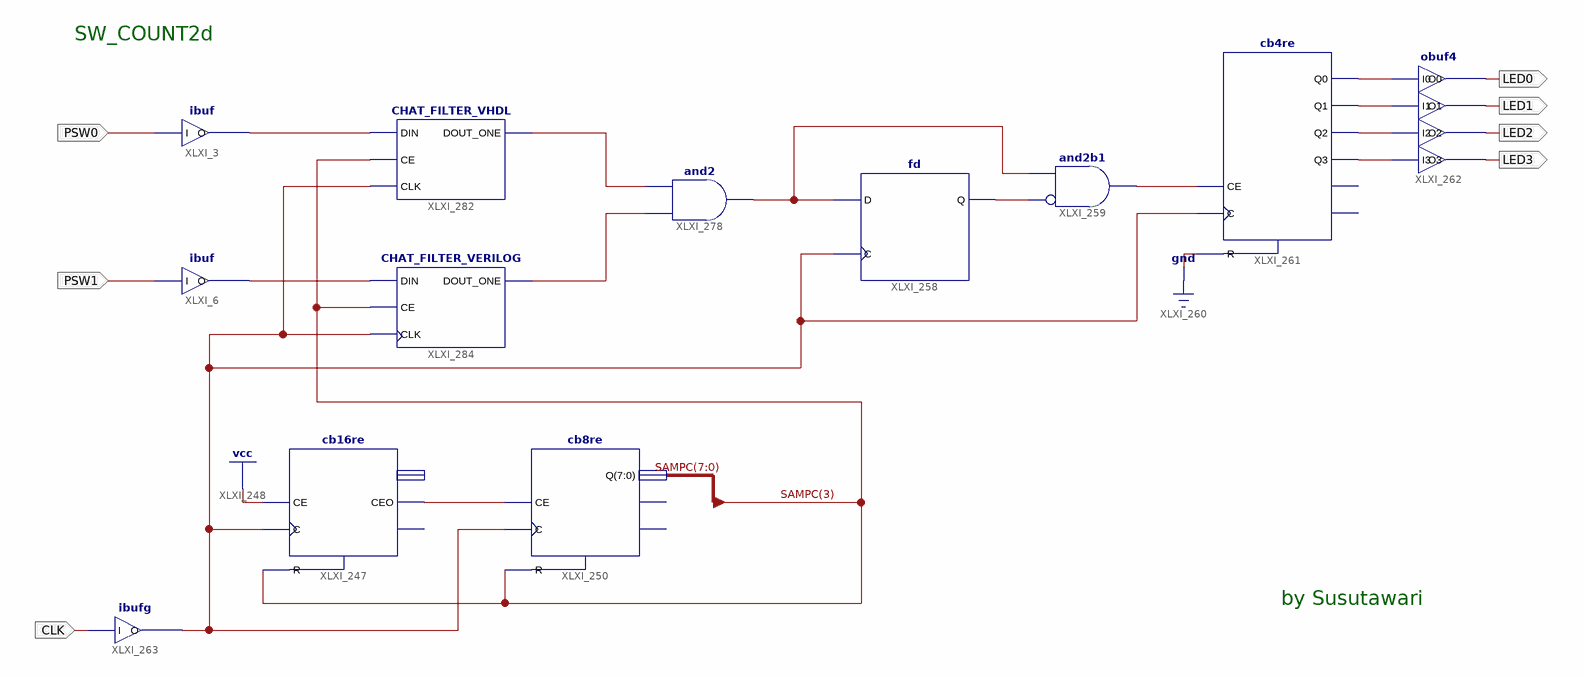
[diagram p0: schematic sheet 1]
// Xilinx ISE schematic SW_COUNT2d.sch (spartan3a) as structural Verilog: 12 symbols, 7 ports
module SW_COUNT2d (
  input  CLK,
  input  PSW0,
  input  PSW1,
  output LED0,
  output LED1,
  output LED2,
  output LED3
);

  wire LA_CLK, LAA0, XLXN_1216, XLXN_1219, XLXN_1235, XLXN_1236, XLXN_1245, XLXN_1246, XLXN_1247, XLXN_1248,
       XLXN_1369, XLXN_1370, XLXN_1374;
  wire [7:0] SAMPC;

  cb16re XLXI_247 (.C(LA_CLK), .CE(1'b1), .R(SAMPC[3]), .CEO(XLXN_1216));  // open: Q, TC
  cb8re XLXI_250 (.C(LA_CLK), .CE(XLXN_1216), .R(SAMPC[3]), .Q(SAMPC));  // open: CEO, TC
  ibufg XLXI_263 (.I(CLK), .O(LA_CLK));
  ibuf XLXI_3 (.I(PSW0), .O(LAA0));
  ibuf XLXI_6 (.I(PSW1), .O(XLXN_1219));
  and XLXI_278 (XLXN_1374, XLXN_1370, XLXN_1369);
  fd XLXI_258 (.C(LA_CLK), .D(XLXN_1374), .Q(XLXN_1235));
  and XLXI_259 (XLXN_1236, ~XLXN_1235, XLXN_1374);  // and2b1
  cb4re XLXI_261 (
    .C(LA_CLK), .CE(XLXN_1236), .R(1'b0), .Q0(XLXN_1245), .Q1(XLXN_1246), .Q2(XLXN_1247), .Q3(XLXN_1248));  // open: CEO, TC
  obuf4 XLXI_262 (
    .I0(XLXN_1245), .I1(XLXN_1246), .I2(XLXN_1247), .I3(XLXN_1248), .O0(LED0), .O1(LED1), .O2(LED2), .O3(LED3));
  CHAT_FILTER_VHDL XLXI_282 (.DIN(LAA0), .CE(SAMPC[3]), .CLK(LA_CLK), .DOUT_ONE(XLXN_1369));
  CHAT_FILTER_VERILOG XLXI_284 (.DIN(XLXN_1219), .CE(SAMPC[3]), .CLK(LA_CLK), .DOUT_ONE(XLXN_1370));

  // Notes on the sheet:
  //   SW_COUNT2d
  //   by Susutawari
endmodule
